# EAGLE design dual HX711 loadcell hytech v1 (EAGLE 9.5.0)
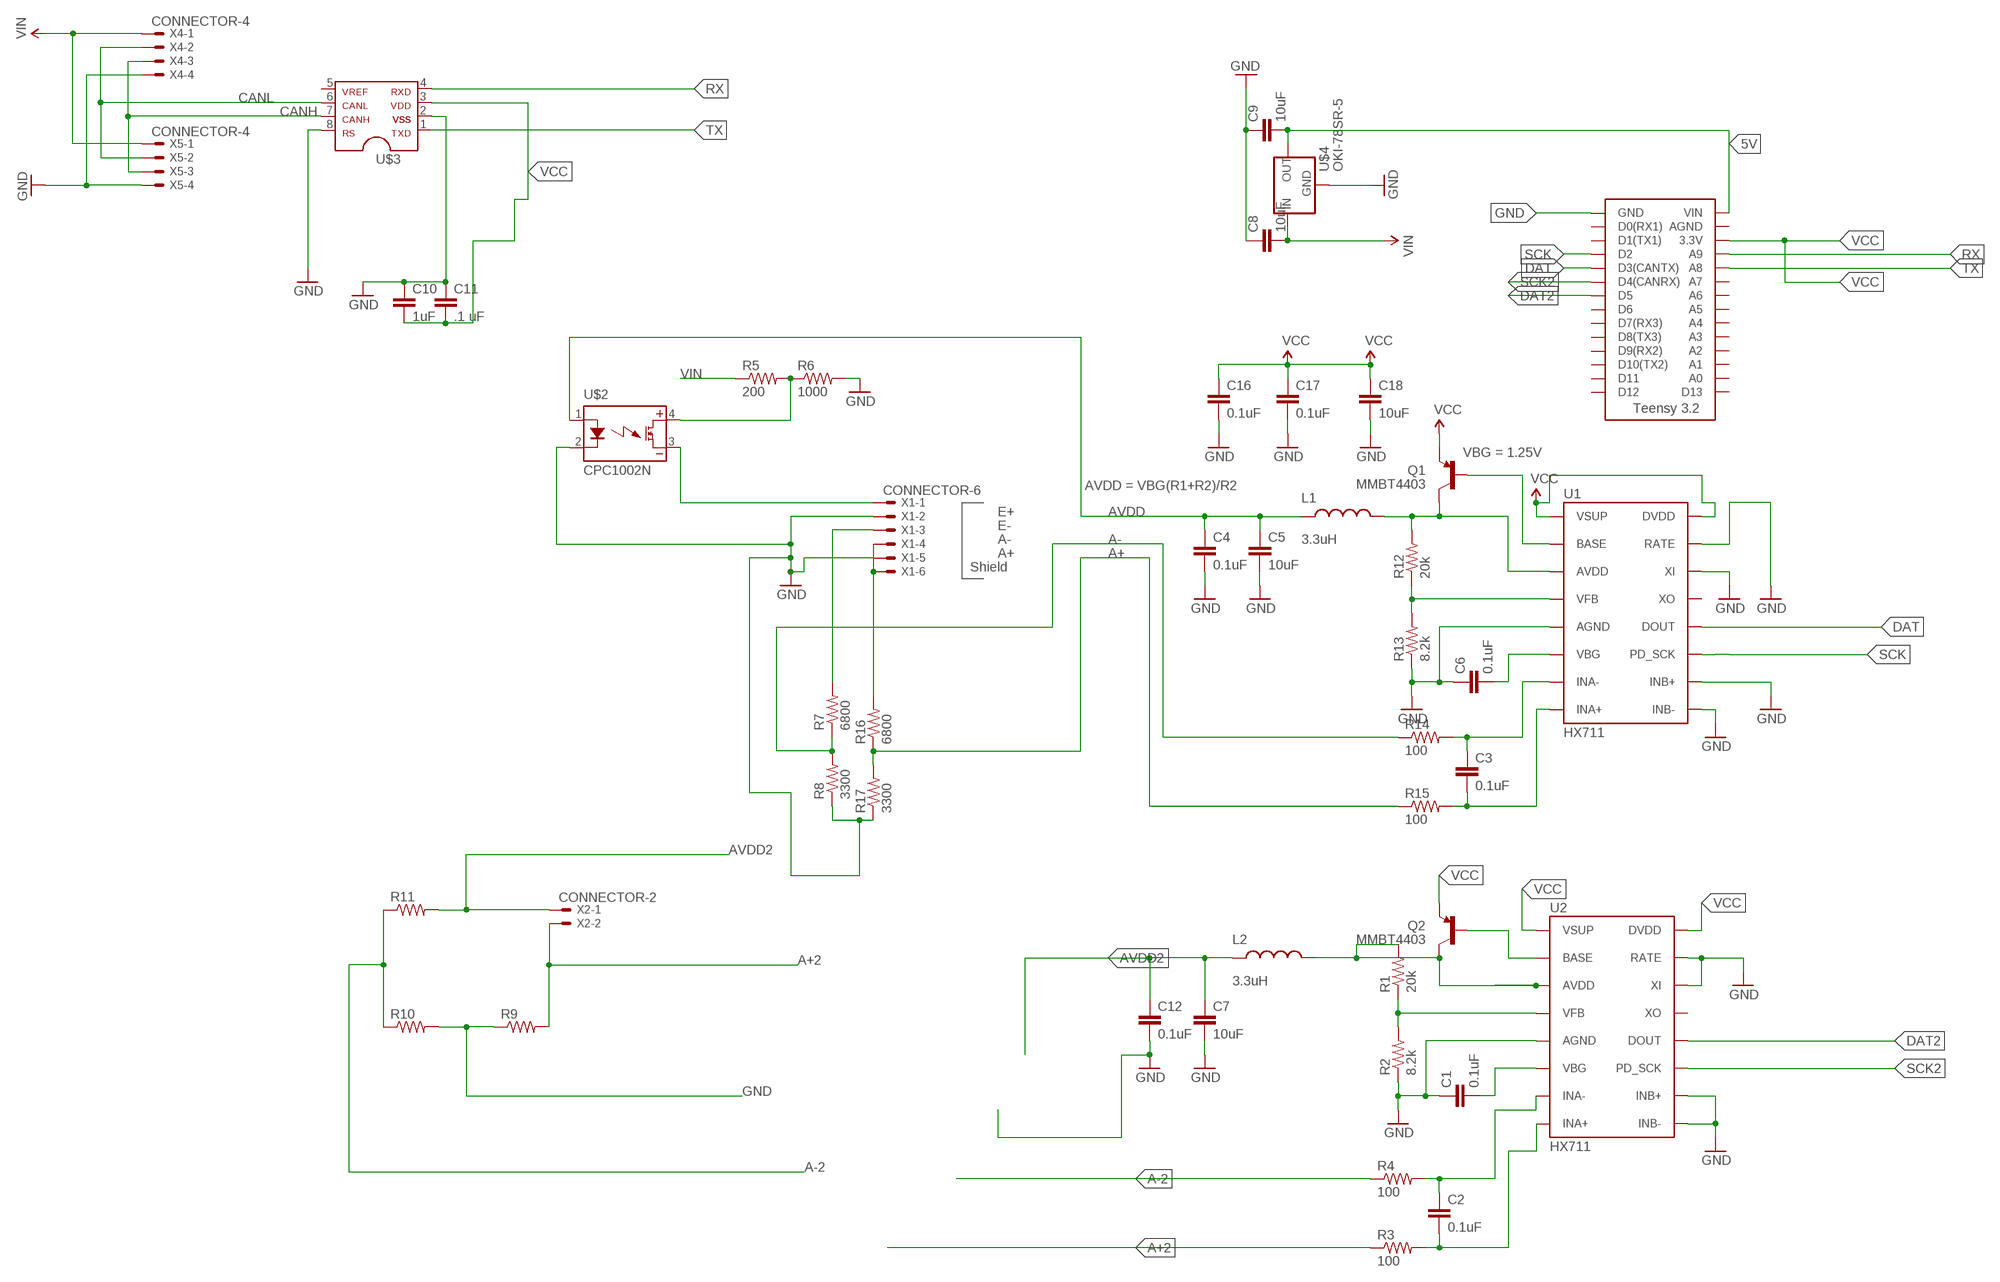
[diagram p0: schematic, sheet 1]

## Parts
C1  0.1uF  CAP0805  [0805]
C2  0.1uF  CAP0805  [0805]
C3  0.1uF  CAP0805  [0805]
C4  0.1uF  CAP0805  [0805]
C5  10uF  CAP0805  [0805]
C6  0.1uF  CAP0805  [0805]
C7  10uF  CAP0805  [0805]
C8  10uF  CAP0805  [0805]
C9  10uF  CAP0805  [0805]
C10  1uF  CAP0805  [0805]
C11  .1 uF  CAP0805  [0805]
C12  0.1uF  CAP0805  [0805]
C16  0.1uF  CAP0805  [0805]
C17  0.1uF  CAP0805  [0805]
C18  10uF  CAP0805  [0805]
L1  3.3uH  INDUCTOR0805-IND  [0805]
L2  3.3uH  INDUCTOR0805-IND  [0805]
Q1  MMBT4403  TRANSISTOR_PNPMMBT4403  [SOT23-3]
Q2  MMBT4403  TRANSISTOR_PNPMMBT4403  [SOT23-3]
R1  20k  RESISTOR0805-RES  [0805]
R2  8.2k  RESISTORAXIAL-0.3  [AXIAL-0.3]
R3  100  RESISTORAXIAL-0.3  [AXIAL-0.3]
R4  100  RESISTORAXIAL-0.3  [AXIAL-0.3]
R5  200  RESISTOR0805-RES  [0805]
R6  1000  RESISTORAXIAL-0.3  [AXIAL-0.3]
R7  6800  RESISTORAXIAL-0.3  [AXIAL-0.3]
R8  3300  RESISTORAXIAL-0.3  [AXIAL-0.3]
R9  RESISTORAXIAL-0.3  [AXIAL-0.3]
R10  RESISTORAXIAL-0.3  [AXIAL-0.3]
R11  RESISTORAXIAL-0.3  [AXIAL-0.3]
R12  20k  RESISTOR0805-RES  [0805]
R13  8.2k  RESISTORAXIAL-0.3  [AXIAL-0.3]
R14  100  RESISTORAXIAL-0.3  [AXIAL-0.3]
R15  100  RESISTORAXIAL-0.3  [AXIAL-0.3]
R16  6800  RESISTORAXIAL-0.3  [AXIAL-0.3]
R17  3300  RESISTORAXIAL-0.3  [AXIAL-0.3]
U1  HX711  HX711HX711  [SO16]
U2  HX711  HX711HX711  [SO16]
U$1  TEENSY_3.2_SIMPLE  [TEENSY_3.2_SIMPLE]
U$2  CPC1002N  [SOP04]
U$3  MCP2551  [SOIC-08]
U$4  OKI-78SR-5  [OKI-78SR]
X1  CONNECTOR-6  [MINIFIT_5566-6]
X2  CONNECTOR-2  [MINIFIT_5566-2]
X4  CONNECTOR-4  [MINIFIT_5566-4]
X5  CONNECTOR-4  [MINIFIT_5566-4]

## Nets
5V: C9.2 U$1.VIN U$4.3(OUT)
A+: R15.P$1 R16.P$1 R17.P$2
A+2: R3.P$1 R9.P$2 X2.2
A-: R7.P$1 R8.P$2 R14.P$1
A-2: R4.P$1 R10.P$1 R11.P$1
AVDD: C4.1 C5.1 L1.1 U$2.1(CONTROL+)
AVDD2: C7.1 C12.1 L2.1 R11.P$2 X2.1
CANH: U$3.7 X4.3 X5.3
CANL: U$3.6 X4.2 X5.2
DAT: U1.12(DOUT) U$1.D3(CANTX)
DAT2: U2.12(DOUT) U$1.D5
GND: C1.1 C4.2 C5.2 C6.1 C7.2 C8.1 C9.1 C10.1 C11.1 C12.2 C16.2 C17.2 C18.2 R2.P$1 R6.P$2 R8.P$1 R9.P$1 R10.P$2 R13.P$1 R17.P$1 U1.5(AGND) U1.9(INB-) U1.10(INB+) U1.14(XI) U1.15(RATE) U2.5(AGND) U2.9(INB-) U2.10(INB+) U2.14(XI) U2.15(RATE) U$1.GND U$2.2(CONTROL-) U$3.2 U$3.8 U$4.2(GND) X1.2 X1.5 X4.4 X5.4
N$1: Q2.1(B) U2.2(BASE)
N$2: C3.1 R14.P$2 U1.7(INA-)
N$3: C3.2 R15.P$2 U1.8(INA+)
N$4: Q1.1(B) U1.2(BASE)
N$5: L1.2 Q1.3(C) R12.2 U1.3(AVDD)
N$6: R12.1 R13.P$2 U1.4(VFB)
N$7: C6.2 U1.6(VBG)
N$8: C2.1 R4.P$2 U2.7(INA-)
N$9: R1.1 R2.P$2 U2.4(VFB)
N$10: C1.2 U2.6(VBG)
N$11: L2.2 Q2.3(C) R1.2 U2.3(AVDD)
N$12: C2.2 R3.P$2 U2.8(INA+)
N$14: U$2.3(DC-) X1.1
N$15: R5.2 R6.P$1 U$2.4(DC+)
N$16: R7.P$2 X1.3
N$17: R16.P$2 X1.4 X1.6
RX: U$1.A9 U$3.4
SCK: U1.11(PD_SCK) U$1.D2
SCK2: U2.11(PD_SCK) U$1.D4(CANRX)
TX: U$1.A8 U$3.1
VCC: C10.2 C11.2 C16.1 C17.1 C18.1 Q1.2(E) Q2.2(E) U1.1(VSUP) U1.16(DVDD) U2.1(VSUP) U2.16(DVDD) U$1.3.3V U$3.3
VIN: C8.2 R5.1 U$4.1(IN) X4.1 X5.1
Unconnected: U1.13(XO) U2.13(XO) U$1.A0 U$1.A1 U$1.A2 U$1.A3 U$1.A4 U$1.A5 U$1.A6 U$1.A7 U$1.AGND U$1.D0(RX1) U$1.D1(TX1) U$1.D6 U$1.D7(RX3) U$1.D8(TX3) U$1.D9(RX2) U$1.D10(TX2) U$1.D11 U$1.D12 U$1.D13 U$3.5

## Notes on the sheet
- VBG = 1.25V
- AVDD = VBG(R1+R2)/R2
- E+
- E-
- A-
- A+
- Shield

## Library data of the parts
C1-C12 C16-C18 = HyTechDevices:CAP: Capacitor Standard 0603 ceramic capacitor, and 0.1" leaded capacitor.
L1 L2 = SparkFun-Passives:INDUCTOR: Inductors Basic Inductor/Choke - 0603 and 1206. Footprints are not proven and vary greatly between part numbers. INDUCTOR POWER 3.3UH 4.0A SMD 0.197" L x 0.197" W x 0.177" H (5.00mm x 5.00mm x 4.50mm); PROD_ID: NDUC-13076
Q1 Q2 = SparkFun-DiscreteSemi:TRANSISTOR_PNP: Generic PNP BJT Double check pinouts against datasheets- not all devices are the same! MMBT3906 - 40V 200mA SOT-23 (TRANS-08052) MMBT4403 - 40V 600mA SOT-23 (TRANS-09245); PROD_ID: TRANS-09245
R1-R17 = HyTechDevices:RESISTOR: Resistor Basic schematic elements and footprints for 0603, 1206, and PTH resistors.
U1 U2 = Testing:HX711; PROD_ID: IC-12445
U$1 = HyTechDevices:TEENSY_3.2_SIMPLE: Simple version of the Teensy 3.2 board that only uses the 2 main rows of pins, not the inner pins or the pins opposite the usb port.
U$2 = HyTechDevices:CPC1002N: IXYS Solid State Relay .7A
U$3 = HyTechDevices:MCP2551: MCP2551 High-Speed CAN Transceiver Product Webpage <https://www.microchip.com/wwwproducts/en/MCP2551> Datasheet <http://ww1.microchip.com/downloads/en/DeviceDoc/21667f.pdf> This device is outdated It is replaced by MCP2561. Comparison Page <https://www.microchip.com/wwwproducts/ProductCompare/MCP2551/MCP2561> Product Webpage <https://www.microchip.com/wwwproducts/en/MCP2561> Datasheet <http://ww1.microchip.com/downloads/en/DeviceDoc/20005167C.pdf>
U$4 = HyTechDevices:OKI-78SR-5: Murata OKI-78SR 5V 1.5A Non-Isolated Switching Regulator DC/DC - Datasheet <https://power.murata.com/data/power/oki-78sr.pdf>
X1 = HyTechDevices:CONNECTOR-6: Mini-Fit Junior connector 6 pole Source: http://www.molex.com; MPN: 95566-61002; OC_FARNELL: unknown; OC_NEWARK: 22K8620
X2 = HyTechDevices:CONNECTOR-2: Mini-Fit Junior connector 2 pole Source: http://www.molex.com; OC_FARNELL: 1822072; OC_NEWARK: unknown
X4 X5 = HyTechDevices:CONNECTOR-4: Mini-Fit Junior connector 4 pole Source: http://www.molex.com; OC_FARNELL: unknown; OC_NEWARK: unknown

## Board
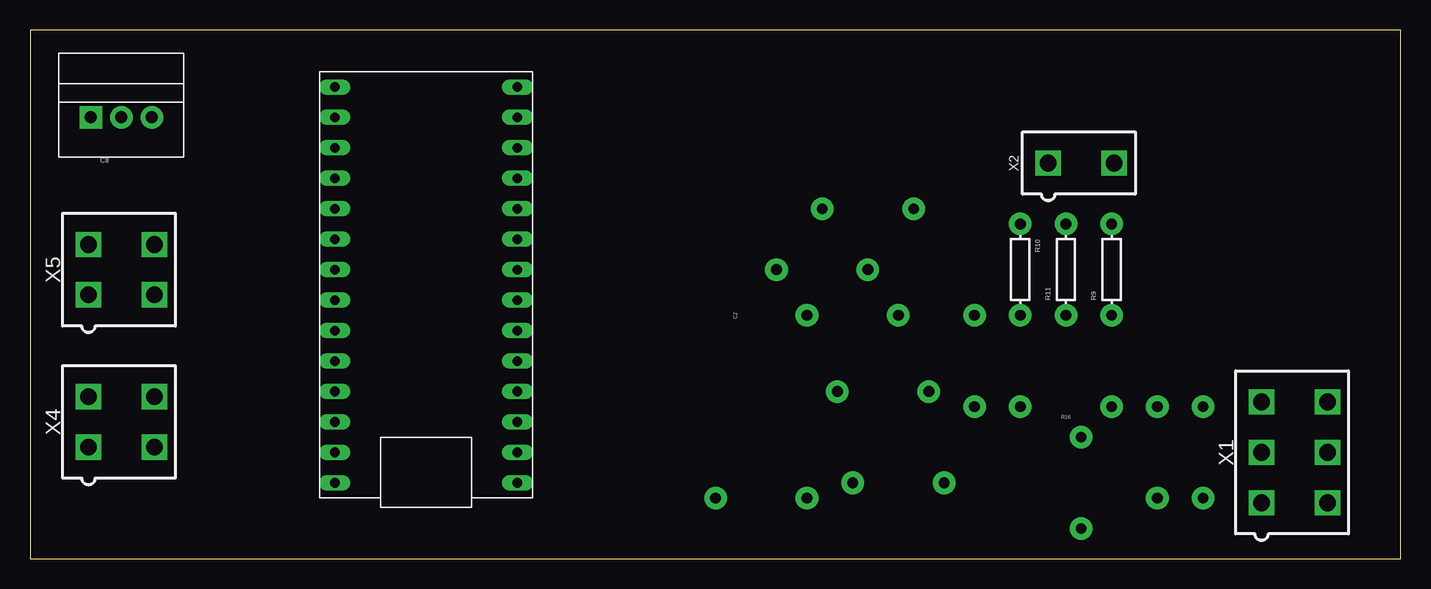
[diagram p1: board, top side]
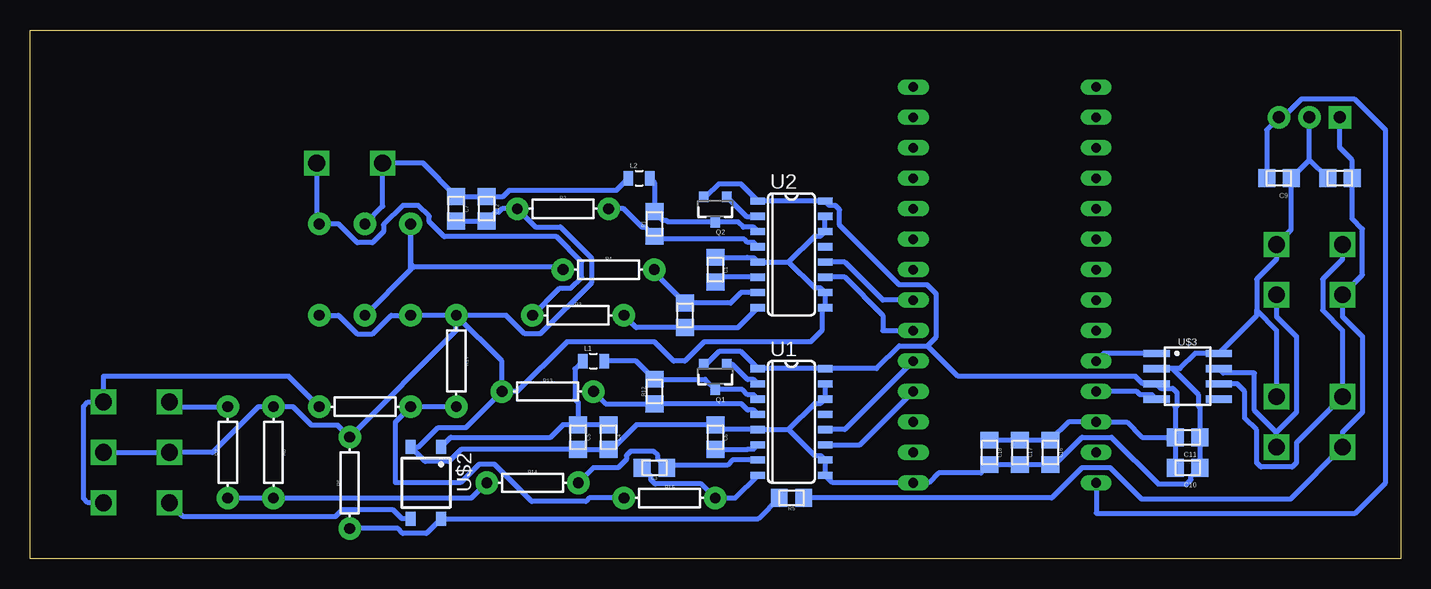
[diagram p2: board, bottom side, seen from below]

Size 114.28 x 44.12 mm. Coordinates in mm from the lower left corner, seen from the top.
Outline: 0,0 114.28,0 114.28,44.12 0,44.12 0,0
Copper layers (1*16): Top 0.035mm / dielectric 1.5mm / Bottom 0.035mm
Design rules "default *": minimum track width 6mil, minimum drill 0.35mm, track to track 16mil, track to pad 16mil, pad to pad 16mil, via to via 16mil, smd to smd 16mil, copper to edge 40mil, drill to drill 6mil, minimum pad ring 10mil, minimum via ring 8mil, stop-mask expansion 4mil, vias tented up to drill 0mil, thermal gap 10mil

### Footprints (pad centres in the part's own frame; a part is rotated, then mirrored left to right if it is on the bottom)
0805 = smd 1.4 x 1.5: 1 -1.025,0; 2 1.025,0
0805' = smd 0.8 x 1.2: 1 -0.9,0; 2 0.9,0
SOT23-3 = smd 0.8 x 0.9: 1 -0.95,-1; 2 0.95,-1; 3 0,1.1
AXIAL-0.3 = drill 0.9 pad 1.88: P$1 -3.81,0; P$2 3.81,0
SO16 = smd 0.6 x 1.2: 1 -4.445,-2.8; 2 -3.175,-2.8; 3 -1.905,-2.8; 4 -0.635,-2.8; 5 0.635,-2.8; 6 1.905,-2.8; 7 3.175,-2.8; 8 4.445,-2.8; 9 4.445,2.8; 10 3.175,2.8; 11 1.905,2.8; 12 0.635,2.8; 13 -0.635,2.8; 14 -1.905,2.8; 15 -3.175,2.8; 16 -4.445,2.8
TEENSY_3.2_SIMPLE = drill 0.8 long: 3.3V 16.51,29.21; A0 16.51,3.81; A1 16.51,6.35; A2 16.51,8.89; A3 16.51,11.43; A4 16.51,13.97; A5 16.51,16.51; A6 16.51,19.05; A7 16.51,21.59; A8 16.51,24.13; A9 16.51,26.67; AGND 16.51,31.75; D0(RX1) 1.27,31.75; D1(TX1) 1.27,29.21; D2 1.27,26.67; D3(CANTX) 1.27,24.13; D4(CANRX) 1.27,21.59; D5 1.27,19.05; D6 1.27,16.51; D7(RX3) 1.27,13.97; D8(TX3) 1.27,11.43; D9(RX2) 1.27,8.89; D10(TX2) 1.27,6.35; D11 1.27,3.81; D12 1.27,1.27; D13 16.51,1.27; GND 1.27,34.29; VIN 16.51,34.29
SOP04 = smd 0.8 x 1.2: 1 -1.27,-3; 2 1.27,-3; 3 1.27,3; 4 -1.27,3
SOIC-08 = smd 0.6 x 2.2: 1 -1.905,-2.6; 2 -0.635,-2.6; 3 0.635,-2.6; 4 1.905,-2.6; 5 1.905,2.6; 6 0.635,2.6; 7 -0.635,2.6; 8 -1.905,2.6
OKI-78SR = drill 1 pad 1.88 square: 1 -2.54,0 | drill 1 pad 1.88: 2 0,0; 3 2.54,0
MINIFIT_5566-6 = drill 1.4 square: 1 4.2,-2.75; 2 0,-2.75; 3 -4.2,-2.75; 4 4.2,2.75; 5 0,2.75; 6 -4.2,2.75
MINIFIT_5566-2 = drill 1.4 square: 1 0,-2.75; 2 0,2.75
MINIFIT_5566-4 = drill 1.4 square: 1 2.1,-2.75; 2 -2.1,-2.75; 3 2.1,2.75; 4 -2.1,2.75

### Placement (x,y rotation side)
C1  57.15,24.13 270 bottom
C2  59.69,20.32 270 bottom
C3  62.23,7.62 180 bottom
C4  66.04,10.16 270 bottom
C5  68.58,10.16 270 bottom
C6  57.15,10.16 270 bottom
C7  78.74,29.21 270 bottom
C8  5.08,31.75 0 bottom
C9  10.16,31.75 180 bottom
C10  17.78,7.62 180 bottom
C11  17.78,10.16 180 bottom
C12  76.2,29.21 270 bottom
C16  29.21,8.89 270 bottom
C17  31.75,8.89 270 bottom
C18  34.29,8.89 270 bottom
L1  3.3uH  [0805']  67.31,16.51 0 bottom
L2  3.3uH  [0805']  63.5,31.75 0 bottom
Q1  57.15,15.24 180 bottom
Q2  57.15,29.21 180 bottom
R1  62.23,27.94 90 bottom
R2  69.85,29.21 0 bottom
R3  68.58,20.32 0 bottom
R4  66.04,24.13 0 bottom
R5  50.8,5.08 180 bottom
R6  87.63,6.35 90 bottom
R7  97.79,8.89 90 bottom
R8  93.98,8.89 270 bottom
R9  90.17,24.13 90 top
R10  82.55,24.13 270 top
R11  86.36,24.13 90 top
R12  62.23,13.97 90 bottom
R13  71.12,13.97 0 bottom
R14  72.39,6.35 0 bottom
R15  60.96,5.08 0 bottom
R16  86.36,12.7 180 bottom
R17  78.74,16.51 270 bottom
U1  50.8,11.43 270 bottom
U2  50.8,25.4 270 bottom
U$1  41.91,40.64 180 top
U$2  81.28,6.35 180 bottom
U$3  17.78,15.24 270 bottom
U$4  7.62,36.83 0 top
X1  105.41,8.89 270 top
X2  87.63,33.02 270 top
X4  7.62,11.43 270 top
X5  7.62,24.13 270 top

### Tracks (layer width: path | path; a pad name or v marks a point on that pad's centre or on a via)
5V
  Bottom 0.406: C9.2 11.18,35.8 U$4.3 9.81,36.83 8.26,38.38 3.89,38.38 1.27,35.76 1.27,6.35 3.81,3.81 25.4,3.81 U$1.VIN
A+
  Bottom 0.406: R15.P$1 67.66,5.08 67.94,4.8 72.46,4.8 75.56,7.9 76.84,7.9 78.39,6.35 83.82,6.35 83.82,11.43 R16.P$1 R17.P$2
A+2
  Bottom 0.406: X2.2 90.38,28.15 R9.P$2 88.55,27.94 87,26.39 85.72,26.39 84.81,27.3 84.81,27.87 83.19,29.49 81.91,29.49 81,28.58 81,28.13 79.74,26.88 70.4,26.88 68.3,24.77 68.3,23.49 69.21,22.58 70.13,22.58 R3.P$1
A-
  Bottom 0.406: R7.P$1 R8.P$2 77.47,5.08 R14.P$1
A-2
  Bottom 0.406: R11.P$1 82.55,24.13 R10.P$1 82.55,24.6 82.28,24.34 70.06,24.34 R4.P$1
AVDD
  Bottom 0.406: C4.1 C5.1 | U$2.1 79.2,10.16 70.88,10.16 69.85,11.19 C5.1 | C5.1 68.58,13.05 68.86,13.33 68.86,15.86 L1.1
AVDD2
  Bottom 0.406: R11.P$2 84.88,29.42 X2.1 81.53,33.02 C7.1 C12.1 74.83,30.23 74.3,30.76 65.39,30.76 L2.1
CANH
  Bottom 0.406: X5.3 10.37,20.22 8.71,18.56 8.71,12.23 10.37,10.57 | U$3.7 14.82,15.52 12.2,15.52 12.2,12.4 10.37,10.57 | X4.3 10.37,10.57
CANL
  Bottom 0.406: X5.2 4.87,24.99 6.53,23.33 6.53,20.73 4.87,19.07 X4.2 8.71,9.69 8.71,8.03 9.07,7.67 11.67,7.67 12.03,8.03 12.03,10.76 13.01,11.74 13.01,13.97 13.65,14.61 U$3.6
DAT
  Bottom 0.406: U$1.D3(CANTX) 46.36,10.79 U1.12
DAT2
  Bottom 0.406: U$1.D5 43.18,21.59 46.36,24.77 U2.12
GND
  Bottom 0.406: 12.03,20.73 12.03,23.33 10.37,24.99 X5.4 9.14,27.46 C9.1 7.62,33.27 | X4.4 10.37,19.07 12.03,20.73 | C8.1 7.62,33.27 | 7.62,33.27 U$4.2 | 19.05,15.88 18.41,15.88 17.14,17.14 U$3.8 12.03,20.3 12.03,20.73 | 19.05,15.88 U$3.2 | 19.05,15.88 16.89,13.71 16.89,12.78 16.75,12.65 C11.1 C10.1 17.5,6.88 17.5,6.62 17.85,6.26 20.23,6.26 24.12,10.15 26.58,10.15 28.87,7.87 C16.2 C17.2 C18.2 34.99,7.16 38.54,7.16 39.35,6.35 U$1.GND 47.36,6.35 U1.9 U1.10 48.36,8.62 48.85,8.62 51.03,10.79 | R9.P$1 88.55,20.32 87,18.77 85.72,18.77 84.17,20.32 R10.P$2 R17.P$1 | U2.15 U2.14 48.36,26.95 48.85,26.95 51.03,24.77 | U1.15 U1.14 48.36,12.97 48.85,12.97 51.03,10.79 | 51.03,10.79 U1.5 56.76,10.79 C6.1 63.73,11.19 65.78,9.13 C4.2 C5.2 78.36,9.13 79.36,8.14 81.34,8.14 U$2.2 81.87,9.35 80.25,10.97 77.93,10.97 R13.P$1 | 51.03,24.77 U2.5 53.96,25.12 54.45,25.12 54.48,25.16 C1.1 | 51.03,24.77 48.85,22.59 48.36,22.59 U2.10 U2.9 48.26,20.7 48.26,19.05 49.2,18.11 58.09,18.11 59.69,16.51 60.63,16.51 62.23,18.11 69.52,18.11 73.66,13.97 R13.P$1 | R13.P$1 74.93,16.51 R17.P$1 | R17.P$1 78.74,19.05 R6.P$2 88.62,11.15 90.81,11.15 92.36,12.7 R8.P$1 95.25,12.7 99.06,8.89 X1.2 X1.5 | C7.2 C12.2 75.46,28.93 75.2,28.93 74.91,29.21 R2.P$1 72.14,27.69 70.07,27.69 67.49,25.11 67.49,23.03 71.75,18.77 73.03,18.77 74.58,20.32 R17.P$1
N$1
  Bottom 0.406: Q2.1 54.56,28.57 U2.2
N$2
  Bottom 0.406: U1.7 55.72,8.26 56.15,7.83 61,7.83 C3.1 61.95,8.36 61.95,8.62 62.3,8.98 64.21,8.98 64.56,8.62 64.56,8.3 65.24,7.62 67.31,7.62 R14.P$2
N$3
  Bottom 0.406: U1.8 55.51,5.08 R15.P$2 58.33,6.26 62.16,6.26 62.52,6.62 62.52,6.88 C3.2
N$4
  Bottom 0.406: U1.2 53.96,14.96 54.45,14.96 55.73,16.24 Q1.1
N$5
  Bottom 0.406: U1.3 53.96,13.7 54.45,13.7 54.9,14.14 Q1.3 58.01,14.99 R12.2 63.75,16.51 L1.2
N$6
  Bottom 0.406: U1.4 53.96,12.43 54.45,12.43 54.97,12.95 R12.1 66.28,12.95 R13.P$2
N$7
  Bottom 0.406: C6.2 54.48,9.13 54.45,9.16 53.96,9.16 U1.6
N$8
  Bottom 0.406: U2.7 55,22.23 55.88,21.34 C2.1 62.23,23.89 R4.P$2
N$9
  Bottom 0.406: U2.4 53.96,26.39 54.45,26.39 54.73,26.67 61.98,26.67 R1.1 62.97,27.66 63.23,27.66 64.79,29.21 R2.P$2
N$10
  Bottom 0.406: U2.6 56.76,23.5 C1.2
N$11
  Bottom 0.406: U2.3 53.96,27.66 54.81,27.66 55.25,28.11 Q2.3 61.11,28.11 61.23,28.23 61.49,28.23 R1.2 62.23,31.38 L2.2
N$12
  Bottom 0.406: U2.8 55.26,19.3 C2.2 63.75,19.3 R3.P$2
N$14
  Bottom 0.406: U$2.3 83.26,3.35 84,4.09 88.27,4.09 88.83,3.53 101.5,3.53 X1.1
N$15
  Bottom 0.406: R5.2 53.56,3.35 U$2.4 81.22,2.14 83.2,2.14 83.6,2.54 R6.P$1
N$16
  Bottom 0.406: X1.3 102.27,12.7 R7.P$2
N$17
  Bottom 0.406: X1.4 109.46,4.69 109.82,5.05 109.82,12.73 109.46,13.09 X1.6 108.16,15.24 92.71,15.24 R16.P$2
RX
  Bottom 0.406: U$3.4 20.74,13.7 21.73,13.7 22.01,13.97 U$1.A9
SCK
  Bottom 0.406: U1.11 45.08,9.53 U$1.D2
SCK2
  Bottom 0.406: U$1.D4(CANRX) 43.18,19.05 43.18,20.32 46.36,23.5 U2.11
TX
  Bottom 0.406: U$3.1 24.76,17.14 U$1.A8
VCC
  Bottom 0.406: C11.2 C10.2 | C11.2 18.8,12.65 18.67,12.78 18.67,13.89 19.03,14.24 20.02,14.24 U$3.3 21.49,14.61 22.12,15.23 36.92,15.23 39.46,17.77 | C11.2 21.59,10.16 22.86,11.43 U$1.3.3V 27.69,11.43 C16.1 C17.1 C18.1 | 39.46,17.77 41.82,17.77 43.72,15.88 U1.16 U1.1 55.03,17.3 56.85,17.3 57.91,16.24 Q1.2 | 39.46,17.77 39.46,17.79 38.72,18.53 38.72,22.11 39.47,22.87 41.82,22.87 46.79,27.84 46.79,29.13 47.15,29.48 47.64,29.48 U2.16 U2.1 55.03,31.27 56.85,31.27 57.91,30.21 Q2.2
VIN
  Bottom 0.406: U$4.1 5.08,34.29 4.05,33.27 C8.2 4.05,28.38 3.21,27.53 3.21,23.69 X5.1 4.87,20.22 3.21,18.56 3.21,12.23 4.87,10.57 X4.1 9.21,4.99 21.6,4.99 24.22,7.61 26.58,7.61 29.11,5.08 R5.1